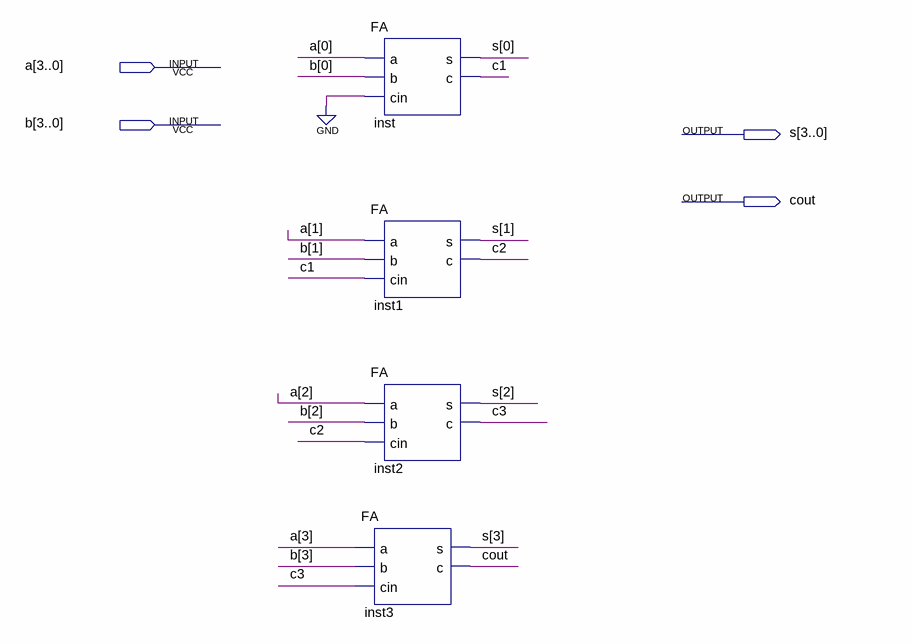
[diagram p0: schematic sheet]
// Quartus schematic fourBitAdder.bdf as structural Verilog: 4 symbols, 4 pins
module fourBitAdder (
  input  [3:0] a,
  input  [3:0] b,
  output [3:0] s,
  output cout
);

  wire c1, c2, c3;

  FA inst (.a(a[0]), .b(b[0]), .cin(1'b0), .s(s[0]), .c(c1));
  FA inst1 (.a(a[1]), .b(b[1]), .cin(c1), .s(s[1]), .c(c2));
  FA inst2 (.a(a[2]), .b(b[2]), .cin(c2), .s(s[2]), .c(c3));
  FA inst3 (.a(a[3]), .b(b[3]), .cin(c3), .s(s[3]), .c(cout));
endmodule
